# EAGLE schematic schematic (EAGLE 6.4)
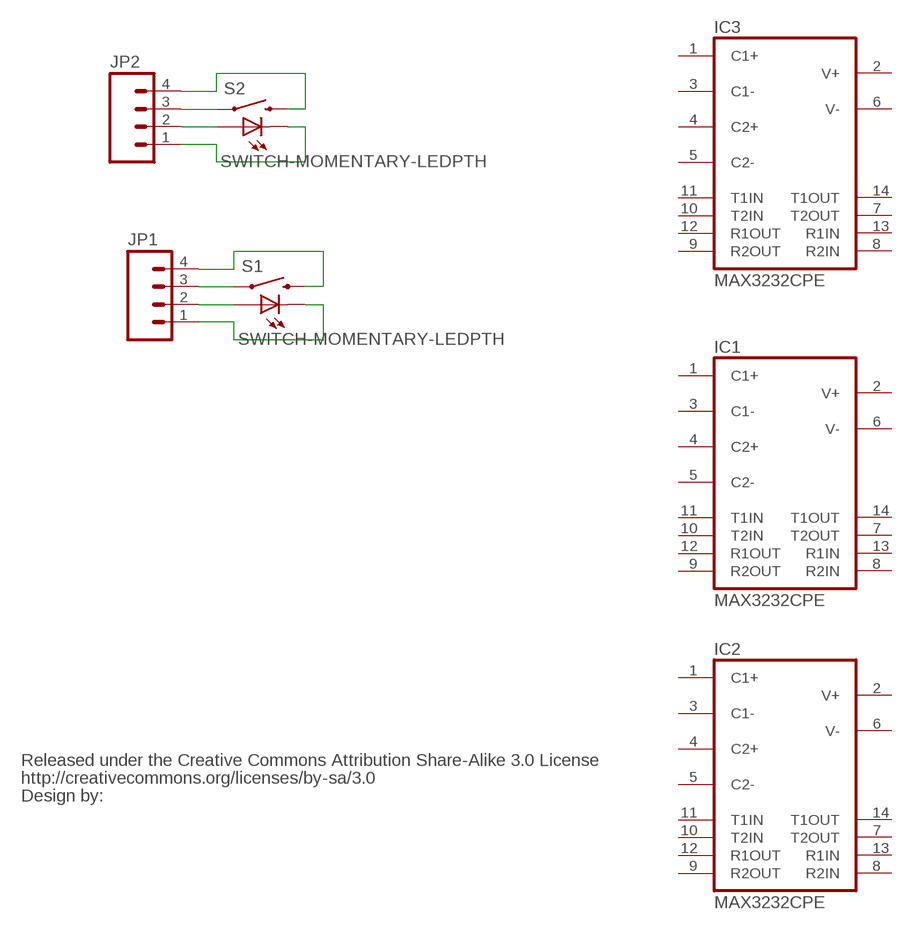
[diagram p0: schematic, sheet 1]

## Parts
CC_TEXT1  CREATIVE_COMMONS  [CREATIVE_COMMONS]
IC1  MAX3232CPE  [DIL16]
IC2  MAX3232CPE  [DIL16]
IC3  MAX3232CPE  [DIL16]
JP1  M04PTH  [1X04]
JP2  M04PTH  [1X04]
S1  SWITCH-MOMENTARY-LEDPTH  [TACTILE-PTH-LED-12MM]
S2  SWITCH-MOMENTARY-LEDPTH  [TACTILE-PTH-LED-12MM]

## Nets
N$1: JP1.4 S1.2
N$2: JP1.3 S1.4
N$3: JP1.2 S1.A
N$4: JP1.1 S1.C
N$5: JP2.4 S2.2
N$6: JP2.3 S2.4
N$7: JP2.2 S2.A
N$8: JP2.1 S2.C
Unconnected: IC1.1(C1+) IC1.2(V+) IC1.3(C1-) IC1.4(C2+) IC1.5(C2-) IC1.6(V-) IC1.7(T2OUT) IC1.8(R2IN) IC1.9(R2OUT) IC1.10(T2IN) IC1.11(T1IN) IC1.12(R1OUT) IC1.13(R1IN) IC1.14(T1OUT) IC2.1(C1+) IC2.2(V+) IC2.3(C1-) IC2.4(C2+) IC2.5(C2-) IC2.6(V-) IC2.7(T2OUT) IC2.8(R2IN) IC2.9(R2OUT) IC2.10(T2IN) IC2.11(T1IN) IC2.12(R1OUT) IC2.13(R1IN) IC2.14(T1OUT) IC3.1(C1+) IC3.2(V+) IC3.3(C1-) IC3.4(C2+) IC3.5(C2-) IC3.6(V-) IC3.7(T2OUT) IC3.8(R2IN) IC3.9(R2OUT) IC3.10(T2IN) IC3.11(T1IN) IC3.12(R1OUT) IC3.13(R1IN) IC3.14(T1OUT)

## Power pins joined to a net without a drawn wire
GND: IC1.15(GND) IC2.15(GND) IC3.15(GND)
VCC: IC1.16(VCC) IC2.16(VCC) IC3.16(VCC)

## Library data of the parts
CC_TEXT1 = SparkFun-Aesthetics:CREATIVE_COMMONS: Creative Commons License summary
IC1-IC3 = maxim:MAX3232*: True RS-232 Transceivers 3.0V to 5.5V, Low-Power up to 1Mbps, Using Four 0.1µF External Capacitors Source: http://pdfserv.maxim-ic.com/en/ds/MAX3222-MAX3241.pdf; MF: MAXIM; MPN: MAX3232CPE+; OC_FARNELL: 9724494; OC_NEWARK: 68K4626
JP1 JP2 = SparkFun:M04: Header 4 Standard 4-pin 0.1" header. Use with straight break away headers (SKU : PRT-00116), right angle break away headers (PRT-00553), swiss pins (PRT-00743), machine pins (PRT-00117), and female headers (PRT-00115). Molex polarized connector foot print use with SKU : PRT-08231 with associated crimp pins and housings. 1MM SMD Version SKU: PRT-10208
S1 S2 = Local Library:SWITCH-MOMENTARY-LED